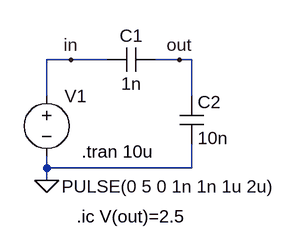
[diagram p0: schematic condo.asc]
condo.asc, the LTspice schematic file:
Version 4
SHEET 1 880 680
WIRE 16 160 -16 160
WIRE 64 160 16 160
WIRE 160 160 128 160
WIRE 176 160 160 160
WIRE -16 208 -16 160
WIRE 176 208 176 160
WIRE -16 304 -16 288
WIRE 176 304 176 272
WIRE 176 304 -16 304
WIRE -16 320 -16 304
FLAG -16 320 0
FLAG 160 160 out
FLAG 16 160 in
SYMBOL voltage -16 192 R0
WINDOW 3 20 136 Left 0
WINDOW 123 0 0 Left 0
WINDOW 39 0 0 Left 0
SYMATTR InstName V1
SYMATTR Value PULSE(0 5 0 1n 1n 1u 2u)
SYMBOL cap 128 144 R90
WINDOW 0 0 32 VBottom 0
WINDOW 3 32 32 VTop 0
SYMATTR InstName C1
SYMATTR Value 1n
SYMBOL cap 160 208 R0
SYMATTR InstName C2
SYMATTR Value 10n
TEXT 30 282 Left 0 !.tran 10u
TEXT 24 368 Left 0 !.ic V(out)=2.5

The netlist it stands for:
* condo.asc
V1 in 0 PULSE(0 5 0 1n 1n 1u 2u)
C1 out in 1n
C2 out 0 10n
.tran 10u
.ic V(out)=2.5
.backanno
.end